# EAGLE design rpi-ledarray-eagle (EAGLE 6.4)
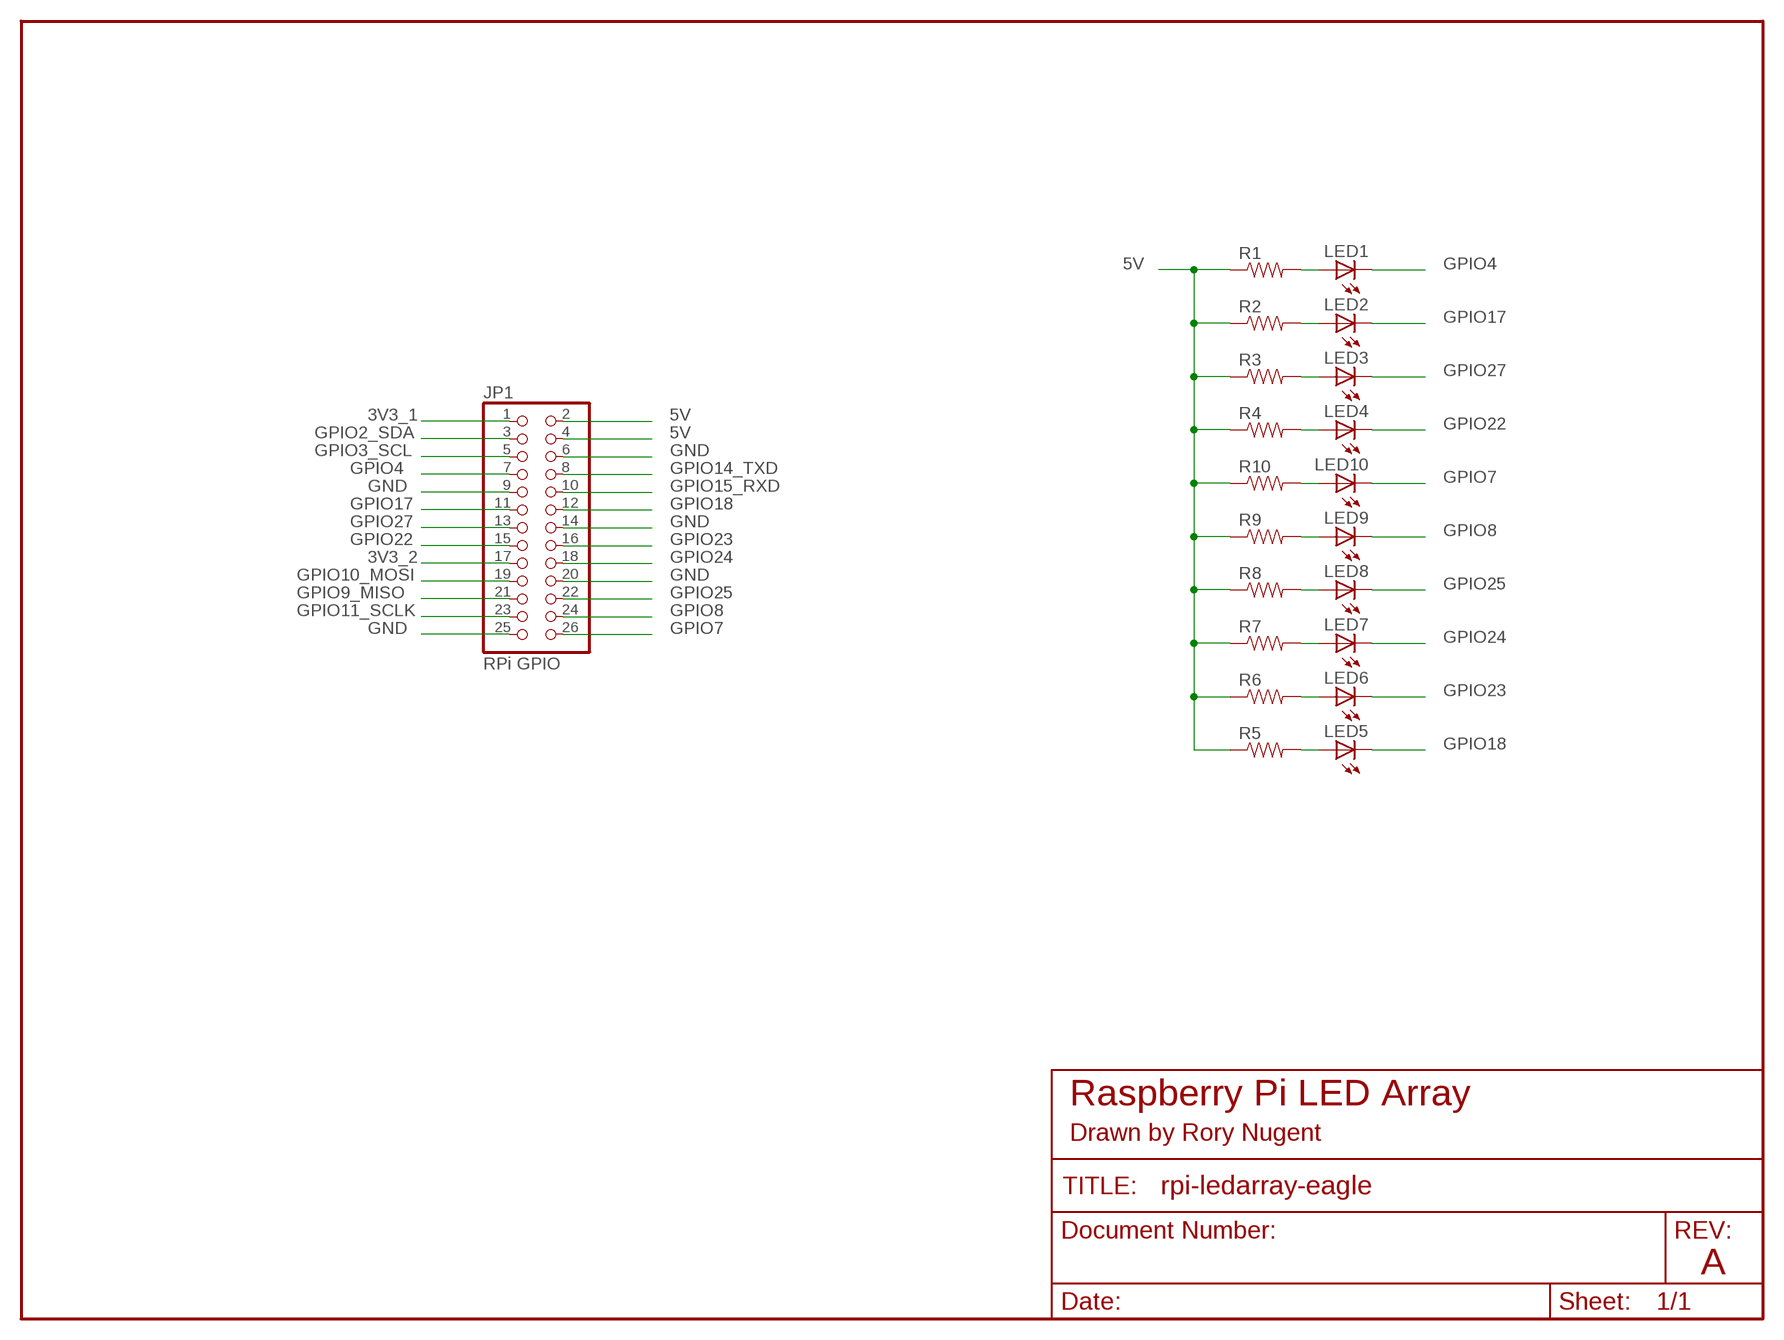
[diagram p0: schematic, sheet 1]

## Parts
JP1  RPi GPIO  PINHD-2X13  [2X13]
LED1  LED1206  [LED-1206]
LED2  LED1206  [LED-1206]
LED3  LED1206  [LED-1206]
LED4  LED1206  [LED-1206]
LED5  LED1206  [LED-1206]
LED6  LED1206  [LED-1206]
LED7  LED1206  [LED-1206]
LED8  LED1206  [LED-1206]
LED9  LED1206  [LED-1206]
LED10  LED1206  [LED-1206]
R1  RESISTOR0603-RES  [0603-RES]
R2  RESISTOR0603-RES  [0603-RES]
R3  RESISTOR0603-RES  [0603-RES]
R4  RESISTOR0603-RES  [0603-RES]
R5  RESISTOR0603-RES  [0603-RES]
R6  RESISTOR0603-RES  [0603-RES]
R7  RESISTOR0603-RES  [0603-RES]
R8  RESISTOR0603-RES  [0603-RES]
R9  RESISTOR0603-RES  [0603-RES]
R10  RESISTOR0603-RES  [0603-RES]

## Nets
3V3_1: JP1.1
3V3_2: JP1.17
5V: JP1.2 JP1.4 R1.1 R2.1 R3.1 R4.1 R5.1 R6.1 R7.1 R8.1 R9.1 R10.1
GND: JP1.6 JP1.9 JP1.14 JP1.20 JP1.25
GPIO2_SDA: JP1.3
GPIO3_SCL: JP1.5
GPIO4: JP1.7 LED1.C
GPIO7: JP1.26 LED10.C
GPIO8: JP1.24 LED9.C
GPIO9_MISO: JP1.21
GPIO10_MOSI: JP1.19
GPIO11_SCLK: JP1.23
GPIO14_TXD: JP1.8
GPIO15_RXD: JP1.10
GPIO17: JP1.11 LED2.C
GPIO18: JP1.12 LED5.C
GPIO22: JP1.15 LED4.C
GPIO23: JP1.16 LED6.C
GPIO24: JP1.18 LED7.C
GPIO25: JP1.22 LED8.C
GPIO27: JP1.13 LED3.C
N$3: LED1.A R1.2
N$4: LED3.A R3.2
N$5: LED2.A R2.2
N$6: LED4.A R4.2
N$10: LED10.A R10.2
N$11: LED9.A R9.2
N$12: LED8.A R8.2
N$13: LED7.A R7.2
N$14: LED6.A R6.2
N$15: LED5.A R5.2

## Notes on the sheet
- Raspberry Pi LED Array
- Drawn by Rory Nugent
- A

## Library data of the parts
JP1 = pinhead:PINHD-2X13: PIN HEADER
LED1-LED10 = SparkFun:LED: LEDs Standard schematic elements and footprints for 5mm, 3mm, 1206, and 0603 sized LEDs. 5mm - Spark Fun Electronics SKU : COM-00529 (and others)
R1-R10 = SparkFun:RESISTOR: Resistor Basic schematic elements and footprints for 0603, 1206, and PTH resistors.

## Board
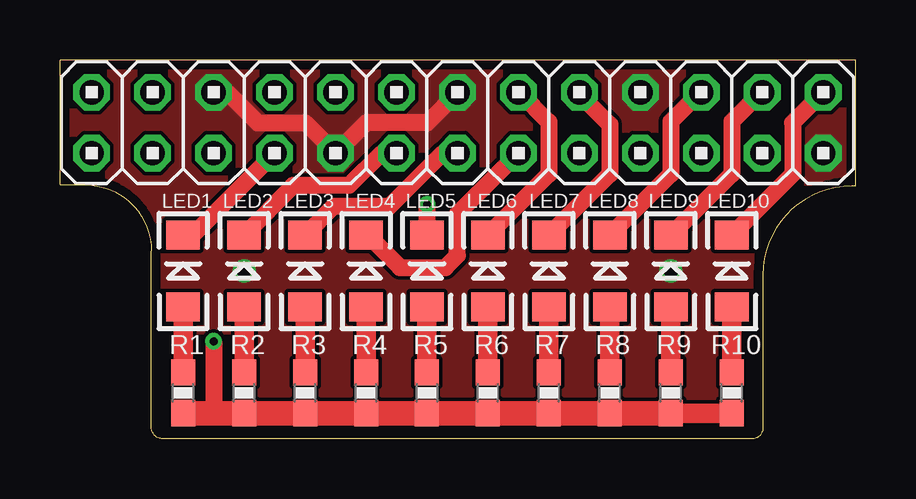
[diagram p1: board, top side]
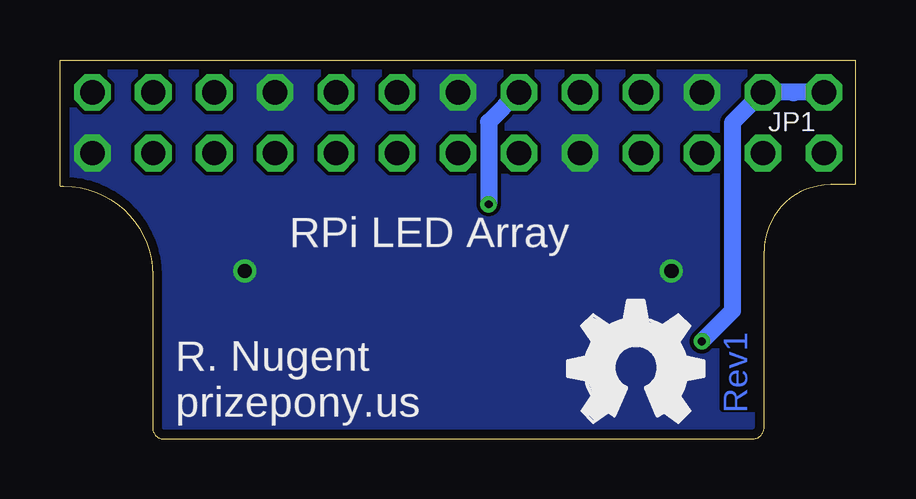
[diagram p2: board, bottom side, seen from below]

Size 33.15 x 15.81 mm. Coordinates in mm from the lower left corner, seen from the top.
Outline: 33.15,15.8 0,15.8 0,10.6 1.04,10.6 arc-90 3.81,7.83 3.81,0.46 arc90 4.27,0.01 28.75,0.01 arc90 29.29,0.39 29.29,6.84 arc-90 32.99,10.55 33.15,10.55 33.15,15.8
Copper layers (1*16): Top 0.0356mm / dielectric 1.5011mm / Bottom 0.0356mm
Design rules "LaenPCBOrder": minimum track width 6mil, minimum drill 13mil, track to track 6mil, track to pad 6mil, pad to pad 6mil, via to via 6mil, smd to smd 6mil, copper to edge 15mil, drill to drill 6mil, minimum pad ring 7mil, minimum via ring 7mil, stop-mask expansion 4mil, vias tented up to drill 0mil, thermal gap 10mil

### Footprints (pad centres in the part's own frame; a part is rotated, then mirrored left to right if it is on the bottom)
2X13 = drill 1.016 octagon: 1 -15.24,-1.27; 2 -15.24,1.27; 3 -12.7,-1.27; 4 -12.7,1.27; 5 -10.16,-1.27; 6 -10.16,1.27; 7 -7.62,-1.27; 8 -7.62,1.27; 9 -5.08,-1.27; 10 -5.08,1.27; 11 -2.54,-1.27; 12 -2.54,1.27; 13 0,-1.27; 14 0,1.27; 15 2.54,-1.27; 16 2.54,1.27; 17 5.08,-1.27; 18 5.08,1.27; 19 7.62,-1.27; 20 7.62,1.27; 21 10.16,-1.27; 22 10.16,1.27; 23 12.7,-1.27; 24 12.7,1.27; 25 15.24,-1.27; 26 15.24,1.27
LED-1206 = smd 1.2 x 1.4: A -1.5,0; C 1.5,0
0603-RES = smd 1.1 x 1: 1 -0.85,0; 2 0.85,0

### Placement (x,y rotation side)
JP1  16.56,13.19 0 top
LED1  5.13,7 90 top
LED2  7.67,7 90 top
LED3  10.21,7 90 top
LED4  12.75,7 90 top
LED5  15.29,7 90 top
LED6  17.83,7 90 top
LED7  20.37,7 90 top
LED8  22.91,7 90 top
LED9  25.45,7 90 top
LED10  27.99,7 90 top
R1  5.13,1.92 90 top
R2  7.67,1.92 90 top
R3  10.21,1.92 90 top
R4  12.75,1.92 90 top
R5  15.29,1.92 90 top
R6  17.83,1.92 90 top
R7  20.37,1.92 90 top
R8  22.91,1.92 90 top
R9  25.45,1.92 90 top
R10  27.99,1.92 90 top
U$2  [OSHW_FILLX200_NOTEXT]  11.99,0.69 0 bottom

### Tracks (layer width: path | path; a pad name or v marks a point on that pad's centre or on a via)
5V  (via drill 0.33)
  Top 0.406: 6.4,1.15 6.35,1.1
  Top 0.711: 6.35,1.1 6.33,1.07 | v6.4,4.07 6.4,1.15
  Top 0.813: R9.1 R10.1
  Top 1.016: R1.1 6.33,1.07 R2.1 R3.1 R4.1 R5.1 R6.1 R7.1 R8.1 R9.1
  Bottom 0.711: JP1.2 2.62,14.46 | 2.62,14.46 JP1.4 5.13,13.19 5.13,5.34 v6.4,4.07 | 2.59,14.43 2.62,14.46
GND  (via drill 0.6)
  Top 0.711: JP1.6 6.96,14.46 8.23,13.19 10.21,13.19 JP1.9 12.75,13.19 15.32,13.19 16.56,14.43 JP1.14
  other vias: 7.67,7 25.45,7
  pour Top (no thermals): -0.51,16.16 -0.51,-1.75 33.53,-1.75 33.53,16.16
  pour Bottom (no thermals): -0.51,16.16 -0.51,-1.75 33.53,-1.75 33.53,16.16
GPIO4
  Top 0.711: LED1.C 5.53,8.5 JP1.7
GPIO7
  Top 0.711: JP1.26 30.53,13.19 30.53,11.04 LED10.C 28,8.52
GPIO8
  Top 0.711: JP1.24 29.21,14.46 27.99,13.24 27.99,11.04 LED9.C
GPIO17
  Top 0.711: JP1.11 13.41,11.92 12.04,10.57 9.71,10.57 LED2.C
GPIO18  (via drill 0.33)
  Top 0.711: v15.29,9.79 LED5.C
  Bottom 0.711: JP1.12 14.05,14.46 15.29,13.21 v15.29,9.79
GPIO22
  Top 0.711: LED4.C 12.81,8.5 14.17,7.14 16.05,7.14 16.56,7.65 16.56,9.38 JP1.15
GPIO23
  Top 0.711: JP1.16 19.13,14.46 20.37,13.21 20.37,11.04 LED6.C
GPIO24
  Top 0.711: JP1.18 21.64,14.38 22.91,13.11 22.91,11.04 LED7.C
GPIO25
  Top 0.711: JP1.22 26.67,14.46 25.45,13.24 25.45,11.04 LED8.C
GPIO27
  Top 0.711: JP1.13 15.95,11.92 13.72,9.68 11.39,9.68 LED3.C
N$3
  Top 0.813: R1.2 LED1.A
N$4
  Top 0.813: LED3.A R3.2
N$5
  Top 0.813: LED2.A R2.2
N$6
  Top 0.813: LED4.A R4.2
N$10
  Top 0.813: LED10.A R10.2
N$11
  Top 0.813: LED9.A R9.2
N$12
  Top 0.813: LED8.A R8.2
N$13
  Top 0.813: LED7.A R7.2
N$14
  Top 0.813: LED6.A R6.2
N$15
  Top 0.813: LED5.A R5.2

### Text on the board
Bottom: Rev1
bNames: RPi LED Array | R. Nugent / prizepony.us